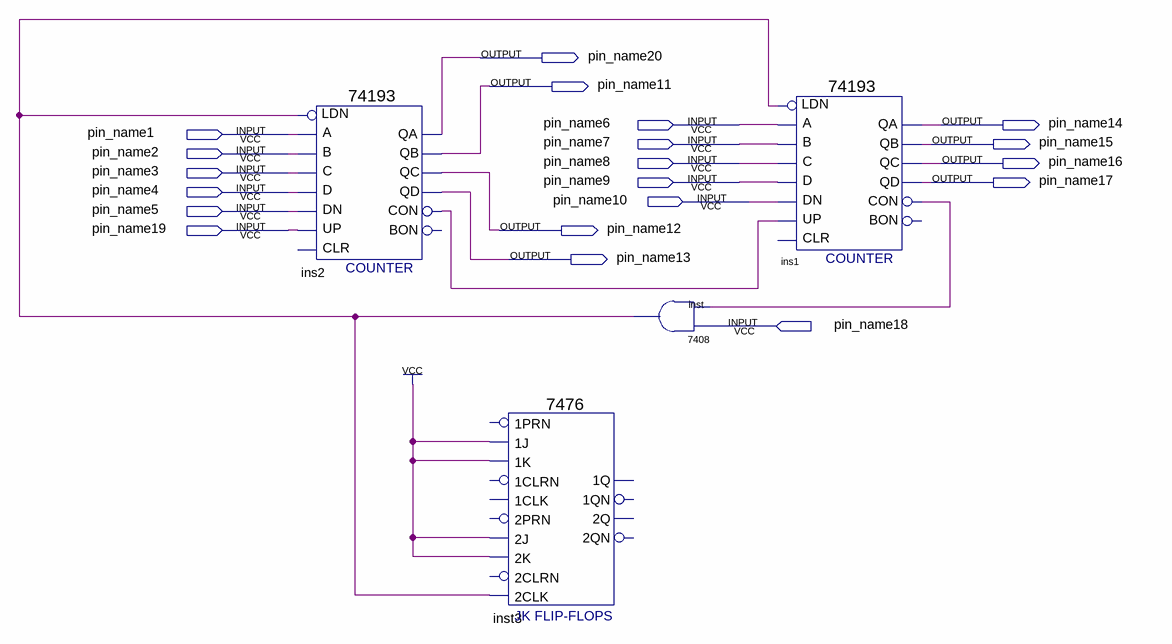
[diagram p0: schematic sheet]
// Quartus schematic TFF.bdf as structural Verilog: 4 symbols, 20 pins
module TFF (
  input  pin_name6,
  input  pin_name1,
  input  pin_name7,
  input  pin_name2,
  input  pin_name8,
  input  pin_name3,
  input  pin_name9,
  input  pin_name4,
  input  pin_name10,
  input  pin_name5,
  input  pin_name19,
  input  pin_name18,
  output pin_name20,
  output pin_name11,
  output pin_name14,
  output pin_name15,
  output pin_name16,
  output pin_name17,
  output pin_name12,
  output pin_name13
);

  wire ins1_con, ins2_con, inst_1;

  \74193  ins2 (
    .D(pin_name4), .C(pin_name3), .B(pin_name2), .A(pin_name1), .UP(pin_name19), .DN(pin_name5),
    .LDN(inst_1), .QB(pin_name11), .QA(pin_name20), .CON(ins2_con), .QD(pin_name13), .QC(pin_name12));  // open: CLR, BON
  \7476  inst3 (
    .\1J (1'b1), .\1K (1'b1), .\2J (1'b1), .\2K (1'b1), .\2CLK (inst_1));  // open: 1PRN, 2PRN, 1CLK, 1CLRN, 2CLRN, 2QN, 1Q, 2Q, 1QN
  \7408  inst (.\3 (ins1_con), .\2 (pin_name18), .\1 (inst_1));
  \74193  ins1 (
    .D(pin_name9), .C(pin_name8), .B(pin_name7), .A(pin_name6), .UP(ins2_con), .DN(pin_name10), .LDN(inst_1),
    .QB(pin_name15), .QA(pin_name14), .CON(ins1_con), .QD(pin_name17), .QC(pin_name16));  // open: CLR, BON
endmodule
